# EAGLE design Atrix_adapter (EAGLE 7.2.0)
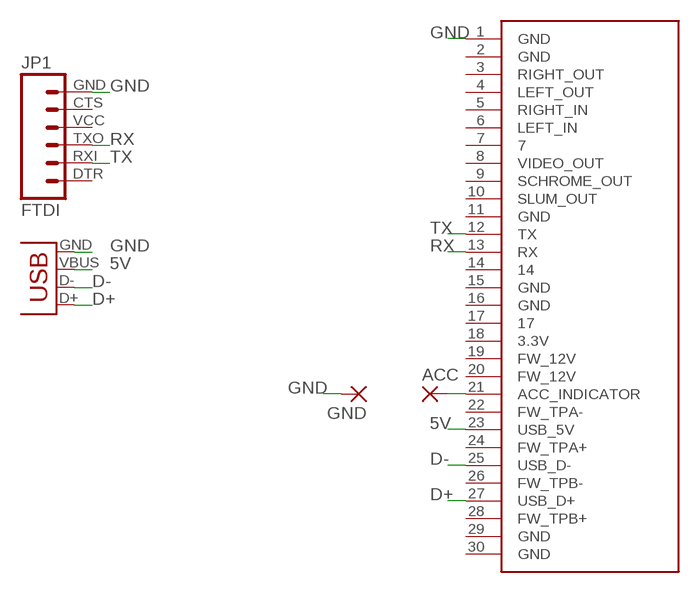
[diagram p0: schematic, sheet 1]

## Parts
ACC  1,6/0,9  [1,6/0,9]
GND  1,6/0,9  [1,6/0,9]
JP1  FTDI  FTDI_BASICPTH  [FTDI_BASIC]
U$1  IPOD_CONNECTOR_MALE  [IPOD_MALE_CONNECTOR]
X1  USB-MICROB  [USB-MICROB]

## Nets
5V: U$1.23(USB_5V) X1.VBUS
D+: U$1.27(USB_D+) X1.D+
D-: U$1.25(USB_D-) X1.D-
GND: GND.1(P) JP1.GND U$1.1(GND) X1.GND
N$1: ACC.1(P) U$1.21(ACC_INDICATOR)
RX: JP1.TXO U$1.13(RX)
TX: JP1.RXI U$1.12(TX)
Unconnected: JP1.CTS JP1.DTR JP1.VCC U$1.2(GND) U$1.3(RIGHT_OUT) U$1.4(LEFT_OUT) U$1.5(RIGHT_IN) U$1.6(LEFT_IN) U$1.7 U$1.8(VIDEO_OUT) U$1.9(SCHROME_OUT) U$1.10(SLUM_OUT) U$1.11(GND) U$1.14 U$1.15(GND) U$1.16(GND) U$1.17 U$1.18(3.3V) U$1.19(FW_12V) U$1.20(FW_12V) U$1.22(FW_TPA-) U$1.24(FW_TPA+) U$1.26(FW_TPB-) U$1.28(FW_TPB+) U$1.29(GND) U$1.30(GND)

## Library data of the parts
ACC GND = wirepad:1,6/0,9: THROUGH-HOLE PAD
JP1 = SparkFun-Connectors:FTDI_BASIC: FTDI Basic header with labels
U$1 = SparkFun-Connectors:IPOD_CONNECTOR_MALE: iPod Male Connector This is the connector that will insert into an iPods. Use this connector to gain access to the various iPod pins. Schematic and footprint are not yet production proven. The PCB thickness must be more thin than the standard 0.062" FR4. Spark Fun Electronics SKU : DEV-00633
X1 = Pinoccio:USB: USB Connectors USB-B-PTH is fully proven SKU : PRT-00139 USB-miniB is fully proven SKU : PRT-00587 USB-A-PCB is untested. USB-A-H is throughly reviewed, but untested. Spark Fun Electronics SKU : PRT-00437 USB-B-SMT is throughly reviewed, but untested. Needs silkscreen touching up. USB-A-S has not been used/tested USB-MB-H has not been used/tested

## Board
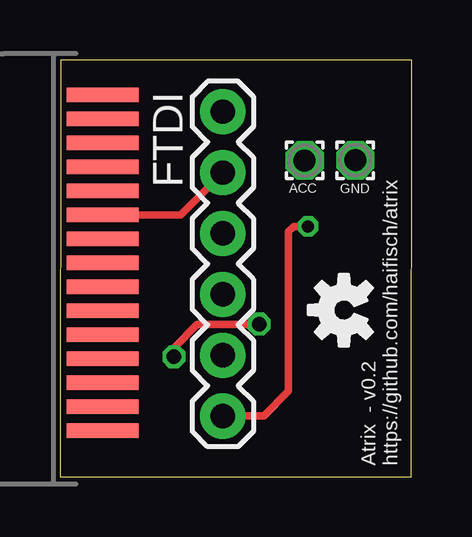
[diagram p1: board, top side]
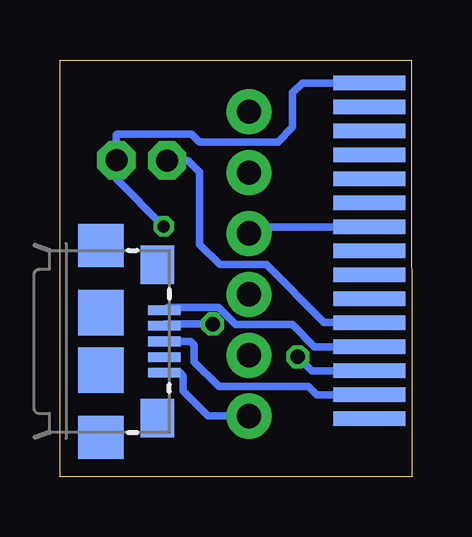
[diagram p2: board, bottom side, seen from below]

Size 14.68 x 17.38 mm. Coordinates in mm from the lower left corner, seen from the top.
Outline: 0,0 14.66,0 14.68,17.38 0.02,17.38 0,0
Copper layers (1*16): Top 0.0356mm / dielectric 1.5011mm / Bottom 0.0356mm
Design rules "LaenPCBOrder": minimum track width 6mil, minimum drill 13mil, track to track 6mil, track to pad 6mil, pad to pad 6mil, via to via 6mil, smd to smd 6mil, copper to edge 15mil, drill to drill 6mil, minimum pad ring 7mil, minimum via ring 7mil, stop-mask expansion 3mil, vias tented up to drill 0mil, thermal gap 10mil

### Footprints (pad centres in the part's own frame; a part is rotated, then mirrored left to right if it is on the bottom)
1,6/0,9 = drill 0.914 pad 1.6 octagon: 1 0,0
FTDI_BASIC = drill 1.016 pad 1.88: CTS 10.16,0; DTR 0,0; GND 12.7,0; RXI 2.54,0; TXO 5.08,0; VCC 7.62,0
IPOD_MALE_CONNECTOR = smd 0.6 x 3 bottom: 1 7.5,0; 3 6.5,0; 5 5.5,0; 7 4.5,0; 9 3.5,0; 11 2.5,0; 13 1.5,0; 15 0.5,0; 17 -0.5,0; 19 -1.5,0; 21 -2.5,0; 23 -3.5,0; 25 -4.5,0; 27 -5.5,0; 29 -6.5,0 | smd 0.6 x 3: 2 7,0; 4 6,0; 6 5,0; 8 4,0; 10 3,0; 12 2,0; 14 1,0; 16 0,0; 18 -1,0; 20 -2,0; 22 -3,0; 24 -4,0; 26 -5,0; 28 -6,0; 30 -7,0
USB-MICROB = smd 0.4 x 1.35: D+ 0,2.65; D- -0.65,2.65; GND 1.3,2.65; ID 0.65,2.65; VBUS -1.3,2.65 | smd 1.8 x 1.9: MT1 -4,0; MT2 4,0 | smd 1.9 x 1.9: MT3 -1.2,0; MT4 1.2,0 | smd 1.6 x 1.4: MT5 3.2,2.35; MT6 -3.2,2.35

### Placement (x,y rotation side)
ACC  10.21,13.18 180 top
GND  12.32,13.19 180 top
JP1  6.79,15.22 270 top
U$1  1.78,8.91 90 top
U$2  [OSHW-LOGO-S]  11.84,6.95 90 top
X1  12.97,5.64 270 bottom

### Tracks (layer width: path | path; a pad name or v marks a point on that pad's centre or on a via)
5V
  Bottom 0.305: U$1.23 4.06,5.41 4.99,6.35 7.35,6.35 8.07,7.07 10.19,7.07 X1.VBUS
D+
  Bottom 0.305: U$1.27 3.96,3.41 4.3,3.75 8.05,3.75 9.08,4.79 9.08,5.48 9.24,5.64 X1.D+
D-  (via drill 0.6)
  Top 0.305: v4.75,5 4.75,5.38 5.73,6.35 v8.31,6.35 v8.31,6.36
  Bottom 0.305: U$1.25 4.17,4.41 v4.75,5 | v8.31,6.36 10.32,6.36 X1.D-
GND  (via drill 0.5)
  Top 0.305: v10.35,10.43 9.75,10.43 9.53,10.22 9.53,3.57 8.5,2.53 6.8,2.53 JP1.GND
  Bottom 0.305: v10.35,10.43 12.32,12.4 GND.1 12.34,13.21 12.34,14.25 12.29,14.29 9.19,14.29 8.86,13.96 5.58,13.96 4.97,14.57 4.97,16.01 4.57,16.41 U$1.1 | X1.GND 9.67,4.34 9.53,4.2 9.53,3.57 8.5,2.53 6.8,2.53 JP1.GND
N$1
  Bottom 0.305: ACC.1 9.34,13.18 8.86,12.7 8.86,9.68 7.99,8.84 6.07,8.84 3.67,6.42 U$1.21
RX
  Bottom 0.305: U$1.13 6.52,10.41 JP1.TXO
TX
  Top 0.305: U$1.12 5.03,10.91 JP1.RXI

### Text on the board
tSilk: Atrix - v0.2 / https://github.com/haifisch/atrix